# Altium schematic sheet MUHTAS-1.SchDoc
size A4; SheetNumber: 1; SheetTotal: 1; websayfasi: web sitesi?; aciklama: aciklama ?; olcu: A4; cizim_no: cizim_no giriniz?; Kontrol: Kontrol ?; versiyon: V?; SPICEModelCacheAYKAHSNS: <root> / <DocumentId>AYKAHSNS</DocumentId> / <CacheFrame Number="0"> / <Model Name="xtal" Kind="CKT"> / <Text>*Generic type:crystal pkg:HC33/51 / .SUBCKT XTAL 1 2 PARAMS: FREQ=1Meg RS=750 C=13pf Q=1000 / LX 1 3 {((Q*RS)/(6.2831852*FREQ))} IC=0.5M / CX 3 4 {(1/(Q*6.2831852*FREQ*RS))} / C0 1 2 {C} / RS 4 2 {RS} / .ENDS XTAL</Text> / </Model> / </CacheFrame> / </root>
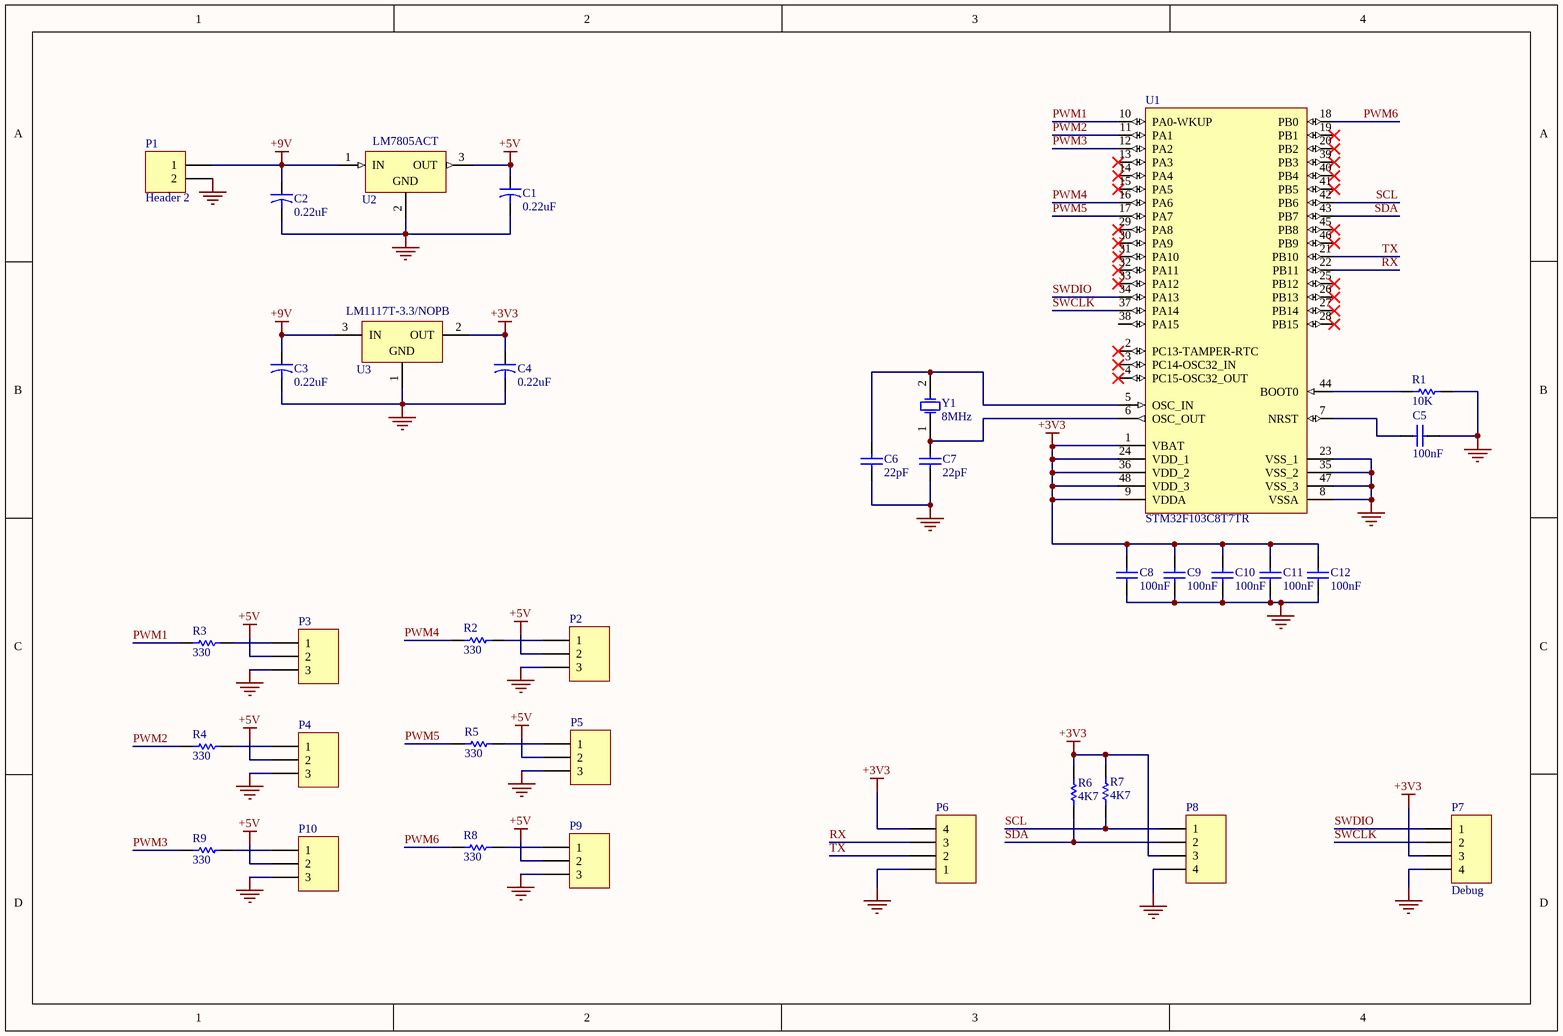
[diagram p0: MUHTAS-1.SchDoc]

## Parts
?  (no value)  (graphical)
C1  0.22uF  [cap_pich_5mm_dia_5mm]
C2  0.22uF  [cap_pich_5mm_dia_5mm]
C3  0.22uF  [cap_pich_5mm_dia_5mm]
C4  0.22uF  [cap_pich_5mm_dia_5mm]
C5  100nF  [1206]
C6  22pF  [mercimek]
C7  22pF  [mercimek]
C8  100nF  [1206]
C9  100nF  [1206]
C10  100nF  [1206]
C11  100nF  [1206]
C12  100nF  [1206]
P1  Header 2  [5mm_Klemens]
P2  Header 3  [header_1x3]  (value not drawn)
P3  Header 3  [header_1x3]  (value not drawn)
P4  Header 3  [header_1x3]  (value not drawn)
P5  Header 3  [header_1x3]  (value not drawn)
P6  Header 4  [HEADER_1X4]  (value not drawn)
P7  Debug  [HEADER_1X4]
P8  Header 4  [HEADER_1X4]  (value not drawn)
P9  Header 3  [header_1x3]  (value not drawn)
P10  Header 3  [header_1x3]  (value not drawn)
R1  10K  [direnc_axial_0.4]
R2  330  [direnc_axial_0.4]
R3  330  [direnc_axial_0.4]
R4  330  [direnc_axial_0.4]
R5  330  [direnc_axial_0.4]
R6  4K7  [direnc_axial_0.4]
R7  4K7  [direnc_axial_0.4]
R8  330  [direnc_axial_0.4]
R9  330  [direnc_axial_0.4]
U1  STM32F103C8T7TR  [STM-LQFP48_M]
U2  LM7805ACT  [FAIR-TO-220-3]
U3  LM1117T-3.3/NOPB  [NDE0003A]
Y1  8MHz  [xtal]

## Nets
+3V3: C4.1 C8.1 C9.1 C10.1 C11.1 C12.1 P6.4 P7.3 P8.3 R6.1 R7.2 U1.1(VBAT) U1.9(VDDA) U1.24(VDD_1) U1.36(VDD_2) U1.48(VDD_3) U3.2(OUT)
+5V: C1.1 P2.2 P3.2 P4.2 P5.2 P9.2 P10.2 U2.3(OUT)
+9V: C2.1 C3.1 P1.1 U2.1(IN) U3.3(IN)
GND: C1.2 C2.2 C3.2 C4.2 C5.2 C6.2 C7.2 C8.2 C9.2 C10.2 C11.2 C12.2 P1.2 P2.3 P3.3 P4.3 P5.3 P6.1 P7.4 P8.4 P9.3 P10.3 R1.1 U1.8(VSSA) U1.23(VSS_1) U1.35(VSS_2) U1.47(VSS_3) U2.2(GND) U3.1(GND)
PWM1: R3.1 U1.10(PA0-WKUP)
PWM2: R4.1 U1.11(PA1)
PWM3: R9.1 U1.12(PA2)
PWM4: R2.1 U1.16(PA6)
PWM5: R5.1 U1.17(PA7)
PWM6: R8.1 U1.18(PB0)
RX: P6.3 U1.22(PB11)
SCL: P8.1 R7.1 U1.42(PB6)
SDA: P8.2 R6.2 U1.43(PB7)
SWCLK: P7.2 U1.37(PA14)
SWDIO: P7.1 U1.34(PA13)
TX: P6.2 U1.21(PB10)
NetC5_1: C5.1 U1.7(NRST)
NetC6_1: C6.1 U1.5(OSC_IN) Y1.2(OSC2)
NetC7_1: C7.1 U1.6(OSC_OUT) Y1.1(OSC1)
NetP2_1: P2.1 R2.2
NetP3_1: P3.1 R3.2
NetP4_1: P4.1 R4.2
NetP5_1: P5.1 R5.2
NetP9_1: P9.1 R8.2
NetP10_1: P10.1 R9.2
NetR1_2: R1.2 U1.44(BOOT0)

Not connected (* = marked no-connect by the designer): U1 2(PC13-TAMPER-RTC)* 3(PC14-OSC32_IN)* 4(PC15-OSC32_OUT)* 13(PA3)* 14(PA4)* 15(PA5)* 19(PB1)* 20(PB2)* 25(PB12)* 26(PB13)* 27(PB14)* 28(PB15)* 29(PA8)* 30(PA9)* 31(PA10)* 32(PA11)* 33(PA12)* 38(PA15) 39(PB3)* 40(PB4)* 41(PB5)* 45(PB8)* 46(PB9)*

## Notes on the sheet
- Ölçü:
- Sayfa Adı:
- Proje Adı:
- Cizim No:
- Revizyon:
- Kontrol Eden:
- Tarih:
- Sayfa:
- -

## Library data of the parts
? = Antet: Standart Antet
C1-C4 = Cap2: Capacitor; Published: 23-Sep-2002; PackageReference: CAPR5-4X5; Publisher: Altium Limited; PackageDescription: Capacitor; 2 Leads; Value: 0.22uF
C5-C12 = Cap: Capacitor; Published: 8-Jun-2000; LatestRevisionDate: 17-Jul-2002; LatestRevisionNote: Re-released for DXP Platform.; PackageReference: RAD-0.3; Publisher: Altium Limited; PackageDescription: Radial Cap, Thru-Hole; 2 Leads; 0.3 in Pin Spacing
  C5 C8-C12: Value: 100nF
  C6 C7: Value: 22pF
P1 = Header 2: Header, 2-Pin; LatestRevisionDate: 17-Jul-2002; LatestRevisionNote: Re-released for DXP Platform.; Publisher: Altium Limited
P2-P5 P9 P10 = Header 3: Header, 3-Pin; LatestRevisionDate: 17-Jul-2002; LatestRevisionNote: Re-released for DXP Platform.; Publisher: Altium Limited
P6-P8 = Header 4: Header, 4-Pin; LatestRevisionDate: 17-Jul-2002; LatestRevisionNote: Re-released for DXP Platform.; Publisher: Altium Limited
R1-R9 = Res1: Resistor; Published: 8-Jun-2000; LatestRevisionDate: 17-Jul-2002; LatestRevisionNote: Re-released for DXP Platform.; PackageReference: AXIAL-0.3; Publisher: Altium Limited; PackageDescription: Axial Device, Thru-Hole; 2 Leads; 0.3 in Pin Spacing
  R1: Value: 10K
  R2-R5 R8 R9: Value: 330
  R6 R7: Value: 4K7
U1 = CMP-0237-00303-2: ARM Cortex-M3 32-bit MCU, 64 KB Flash, 20 KB Internal RAM, 37 I/Os, 48-Pin LQFP, -40 to 105 degC, Tape and Reel; Manufacturer: STMicroelectronics; Operating Frequency(F) (Processor speed) (MHz): 72; Supply Voltage(Vcc) min (V): 2; FLASH Size (Prog) (kB): 64; Internal RAM Size (kB): 20; I/Os (High Current): 36; Package Reference: LQFP48; ComponentLink2Description: Datasheet; ComponentLink2URL: http://www.st.com/st-web-ui/static/active/en/resource/technical/document/datasheet/CD00161566.pdf; ComponentLink1URL: http://www.st.com/; Packing: Tape and Reel; ComponentLink1Description: Manufacturer URL; DatasheetVersion: Rev. 17; Core: ARM Cortex-M3; Mounting Technology: Surface Mount; PartNumber: STM32F103C8T7TR; Package Description: 48-Pin Low Profile Quad Flat Package, Body 7 x 7 mm, Pitch 0.5 mm
U2 = CMP-2000-04937-1: Positive Voltage Regulator, 5 V, 1 A, 0 to 125 degC, 3-Pin TO-220, RoHS, Tube; Manufacturer: Fairchild; Number of Outputs: 1; Typical Dropout Voltage @ Current: 2V@1A; Output Type: Fixed; Output Voltage: 5V; Quiescent Current: 6mA; Dropout Voltage Measurement Current: 1A; Line Regulation: 50mV; Maximum Input Voltage: 35V; Regulator Function: Linear; Load Regulation: 100mV; Package Type: TO-220; Mounting Type: ThroughHole; Height: 16.51mm; Maximum Operating Temperature: +125degC; Datasheet Version: Rev. 1.0.1, 05/2006; Package Reference: TO-220; Minimum Operating Temperature: 0degC; Manufacturer URL: https://www.fairchildsemi.com/; Package URL: https://www.fairchildsemi.com/package-drawings/TO/TO220B03.pdf; Length: 10.67mm; Series: LM78xx; Dimensions: 10.67x4.83x16.51mm; Polarity: Positive; Maximum Output Current: 1A; Pin Count: 3; Width: 4.83mm; Package Description: 3-Pin Through Hole Device, Body 10 x 4.5 mm, Pitch 2.54 mm; Datasheet URL: https://datasheet.ciiva.com/5816/1359194-5816420.pdf
U3 = CMP-0062-02494-3: 800mA Low-Dropout Linear Regulator, 3-pin TO-220, Pb-Free; Manufacturer: Texas Instruments; PackageTopMarking: NSUZXYTTE#*LM1117T*3.3; PowerWise: N; CompType: LDO IC; RoHS: Y; ComponentLink1URL: http://www.ti.com/general/docs/lit/getliterature.tsp?genericPartNumber=LM1117-N&fileType=pdf; PackageReference: NDE0003A; PinCount: 3; ComponentLink1Description: Datasheet URL; PackageDescription: TO-220, Molded, 3 Lead, Straight
Y1 = XTAL: Crystal Oscillator; Published: 8-Jun-2000; LatestRevisionDate: 17-Jul-2002; LatestRevisionNote: Re-released for DXP Platform.; PackageReference: R38; Publisher: Altium Limited; PackageDescription: Crystal, Thru-Hole; 2 Leads; Body 3.1 x 8.2 mm (Dia.xH)